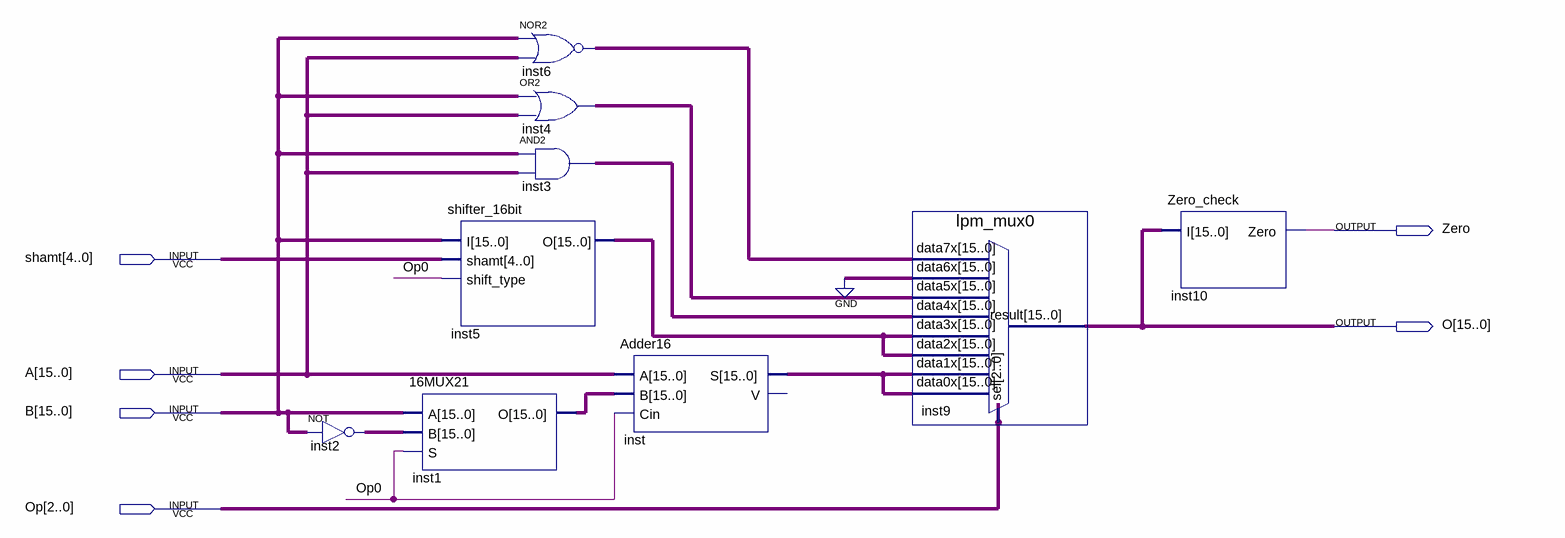
[diagram p0: schematic sheet]
// Quartus schematic AU1.bdf as structural Verilog: 9 symbols, 6 pins
module AU1 (
  input  [4:0] shamt,
  input  [15:0] A,
  input  [15:0] B,
  input  [2:0] Op,
  output Zero,
  output [15:0] O
);

  wire [15:0] inst1_o, inst2_out, inst3_out, inst4_out, inst5_o, inst6_out, inst_s;

  assign inst2_out = ~B;  // NOT inst2, 16 bits wide
  \16MUX21  inst1 (.A(B), .B(inst2_out), .S(Op[0]), .O(inst1_o));
  shifter_16bit inst5 (.I(B), .shamt(shamt), .shift_type(Op[0]), .O(inst5_o));
  assign inst6_out = ~(B | A);  // NOR2 inst6, 16 bits wide
  assign inst4_out = B | A;  // OR2 inst4, 16 bits wide
  assign inst3_out = B & A;  // AND2 inst3, 16 bits wide
  Adder16 inst (.A(A), .B(inst1_o), .Cin(Op[0]), .S(inst_s));  // open: V
  lpm_mux0 inst9 (
    .data7x(inst6_out), .data6x({16{1'b0}}), .data5x(inst4_out), .data4x(inst3_out), .data3x(inst5_o),
    .data2x(inst5_o), .data1x(inst_s), .data0x(inst_s), .sel(Op), .result(O));
  Zero_check inst10 (.I(O), .Zero(Zero));
endmodule
